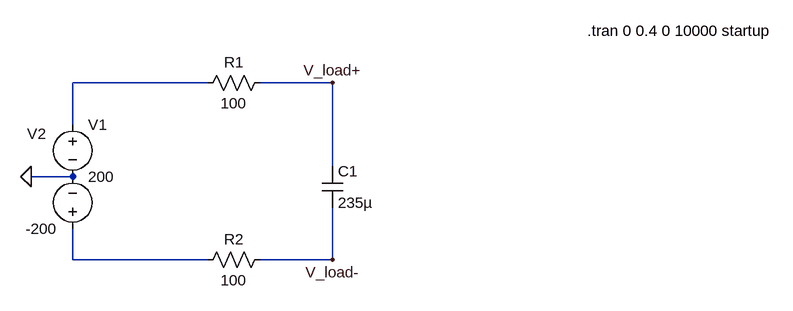
[diagram p0: schematic precharge_2_contactors.asc]
precharge_2_contactors.asc, the LTspice schematic file:
Version 4
SHEET 1 1188 680
WIRE 288 32 80 32
WIRE 480 32 368 32
WIRE 80 96 80 32
WIRE 480 160 480 32
WIRE 80 176 16 176
WIRE 80 304 80 256
WIRE 288 304 80 304
WIRE 480 304 480 224
WIRE 480 304 368 304
FLAG 16 176 0
FLAG 480 32 V_load+
FLAG 480 304 V_load-
SYMBOL voltage 80 80 R0
WINDOW 123 0 0 Left 0
WINDOW 39 0 0 Left 0
SYMATTR InstName V1
SYMATTR Value 200
SYMBOL voltage 80 272 R180
WINDOW 0 41 162 Left 2
WINDOW 3 24 16 Left 2
WINDOW 123 0 0 Left 0
WINDOW 39 0 0 Left 0
SYMATTR InstName V2
SYMATTR Value -200
SYMBOL res 384 16 R90
WINDOW 0 0 56 VBottom 2
WINDOW 3 32 56 VTop 2
SYMATTR InstName R1
SYMATTR Value 100
SYMBOL res 384 288 R90
WINDOW 0 0 56 VBottom 2
WINDOW 3 32 56 VTop 2
SYMATTR InstName R2
SYMATTR Value 100
SYMBOL cap 464 160 R0
SYMATTR InstName C1
SYMATTR Value 235µ
TEXT 872 -48 Left 2 !.tran 0 0.4 0 10000 startup

The netlist it stands for:
* precharge_2_contactors.asc
V1 N001 0 200
V2 N002 0 -200
R1 V_load+ N001 100
R2 V_load- N002 100
C1 V_load+ V_load- 235µ
.tran 0 0.4 0 10000 startup
.backanno
.end

* Results of the author's LTspice run, read from the files saved beside the schematic
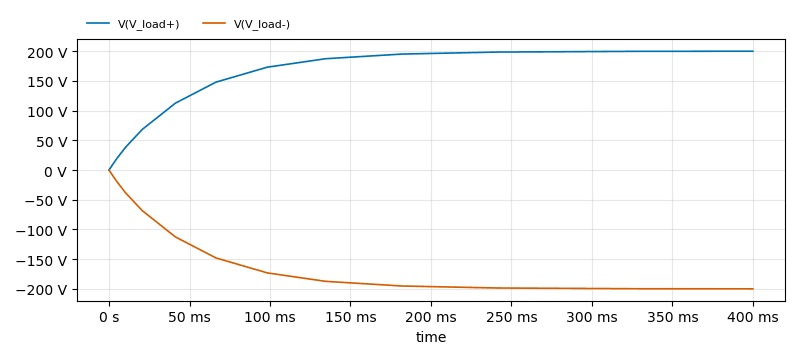
[diagram p1: Transient Analysis of precharge_2_contactors.asc, plotted from the saved traces]
* Transient Analysis, 1 run:
*   V(V_load+): min 0 V, max 200 V, average 174.9 V, rms 180.4 V, last 200 V
*   V(V_load-): min -200 V, max 0 V, average -174.9 V, rms 180.4 V, last -200 V